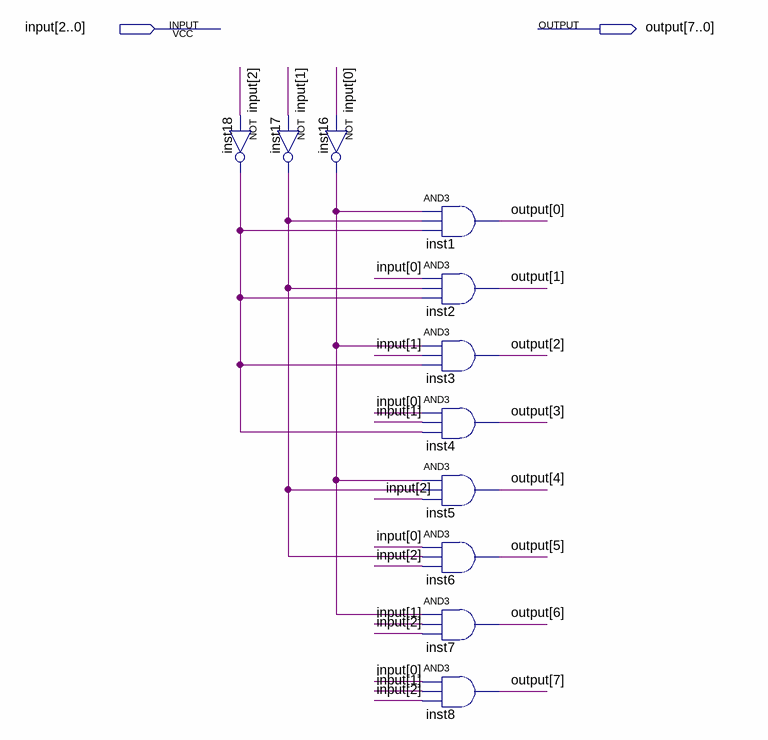
[diagram p0: schematic sheet]
// Quartus schematic DECODER_3x8.bdf as structural Verilog: 11 symbols, 2 pins
module DECODER_3x8 (
  input  [2:0] \input ,
  output [7:0] \output 
);

  wire inst16_out, inst17_out, inst18_out;

  not inst17 (inst17_out, \input [1]);
  not inst18 (inst18_out, \input [2]);
  not inst16 (inst16_out, \input [0]);
  and inst1 (\output [0], inst16_out, inst17_out, inst18_out);
  and inst2 (\output [1], \input [0], inst17_out, inst18_out);
  and inst3 (\output [2], inst16_out, \input [1], inst18_out);
  and inst4 (\output [3], \input [0], \input [1], inst18_out);
  and inst5 (\output [4], inst16_out, inst17_out, \input [2]);
  and inst6 (\output [5], \input [0], inst17_out, \input [2]);
  and inst7 (\output [6], inst16_out, \input [1], \input [2]);
  and inst8 (\output [7], \input [0], \input [1], \input [2]);
endmodule
